# Altium schematic sheet Line driver connector.SchDoc
size A4
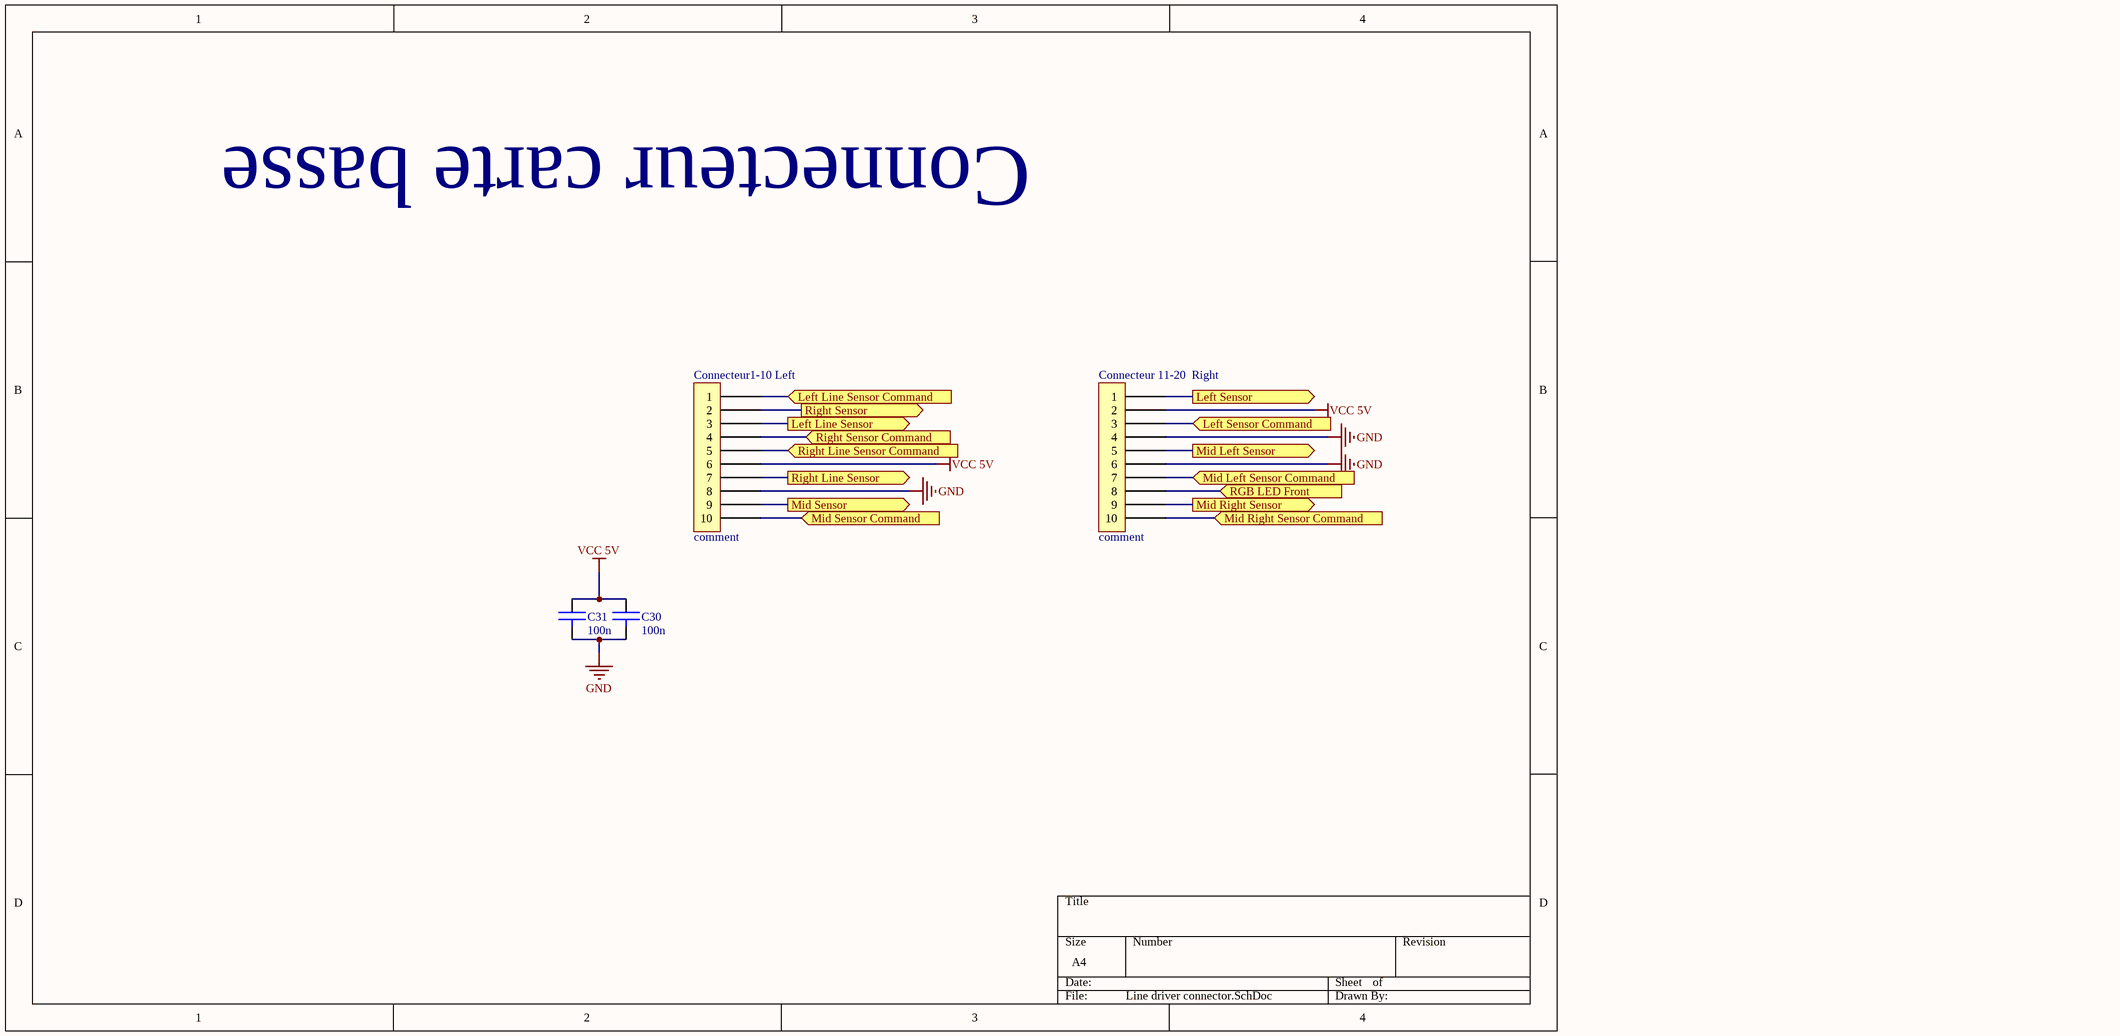
[diagram p0: Line driver connector.SchDoc]

## Parts
C30  value 100n  [0805]  (hidden comment: CAP)
C31  value 100n  [0805]  (hidden comment: CAP)
Connecteur1-10_Left  comment  [HE10-10V]
Connecteur_11-20_Right  comment  [HE10-10V]

## Ports
Left Line Sensor (out), Left Line Sensor Command (in), Left Sensor (out), Left Sensor Command (in), Mid Left Sensor (out), Mid Left Sensor Command (in), Mid Right Sensor (out), Mid Right Sensor Command (in), Mid Sensor (out), Mid Sensor Command (in), RGB LED Front (in), Right Line Sensor (out), Right Line Sensor Command (in), Right Sensor (out), Right Sensor Command (in)

## Nets
GND: C30.2 C31.2 Connecteur1-10_Left.8 Connecteur_11-20_Right.4 Connecteur_11-20_Right.6
VCC 5V: C30.1 C31.1 Connecteur1-10_Left.6 Connecteur_11-20_Right.2
Left Line Sensor: Connecteur1-10_Left.3 ; port Left Line Sensor
Left Line Sensor Command: Connecteur1-10_Left.1 ; port Left Line Sensor Command
Left Sensor: Connecteur_11-20_Right.1 ; port Left Sensor
Left Sensor Command: Connecteur_11-20_Right.3 ; port Left Sensor Command
Mid Left Sensor: Connecteur_11-20_Right.5 ; port Mid Left Sensor
Mid Left Sensor Command: Connecteur_11-20_Right.7 ; port Mid Left Sensor Command
Mid Right Sensor: Connecteur_11-20_Right.9 ; port Mid Right Sensor
Mid Right Sensor Command: Connecteur_11-20_Right.10 ; port Mid Right Sensor Command
Mid Sensor: Connecteur1-10_Left.9 ; port Mid Sensor
Mid Sensor Command: Connecteur1-10_Left.10 ; port Mid Sensor Command
RGB LED Front: Connecteur_11-20_Right.8 ; port RGB LED Front
Right Line Sensor: Connecteur1-10_Left.7 ; port Right Line Sensor
Right Line Sensor Command: Connecteur1-10_Left.5 ; port Right Line Sensor Command
Right Sensor: Connecteur1-10_Left.2 ; port Right Sensor
Right Sensor Command: Connecteur1-10_Left.4 ; port Right Sensor Command

## Notes on the sheet
- Connecteur carte basse

## Library data of the parts
C30 C31 = CAP: capacité non polarisée
Connecteur1-10_Left Connecteur_11-20_Right = HE10-10: 10-pin connector